# EAGLE design jnz-rev4 (EAGLE 7.6.0)
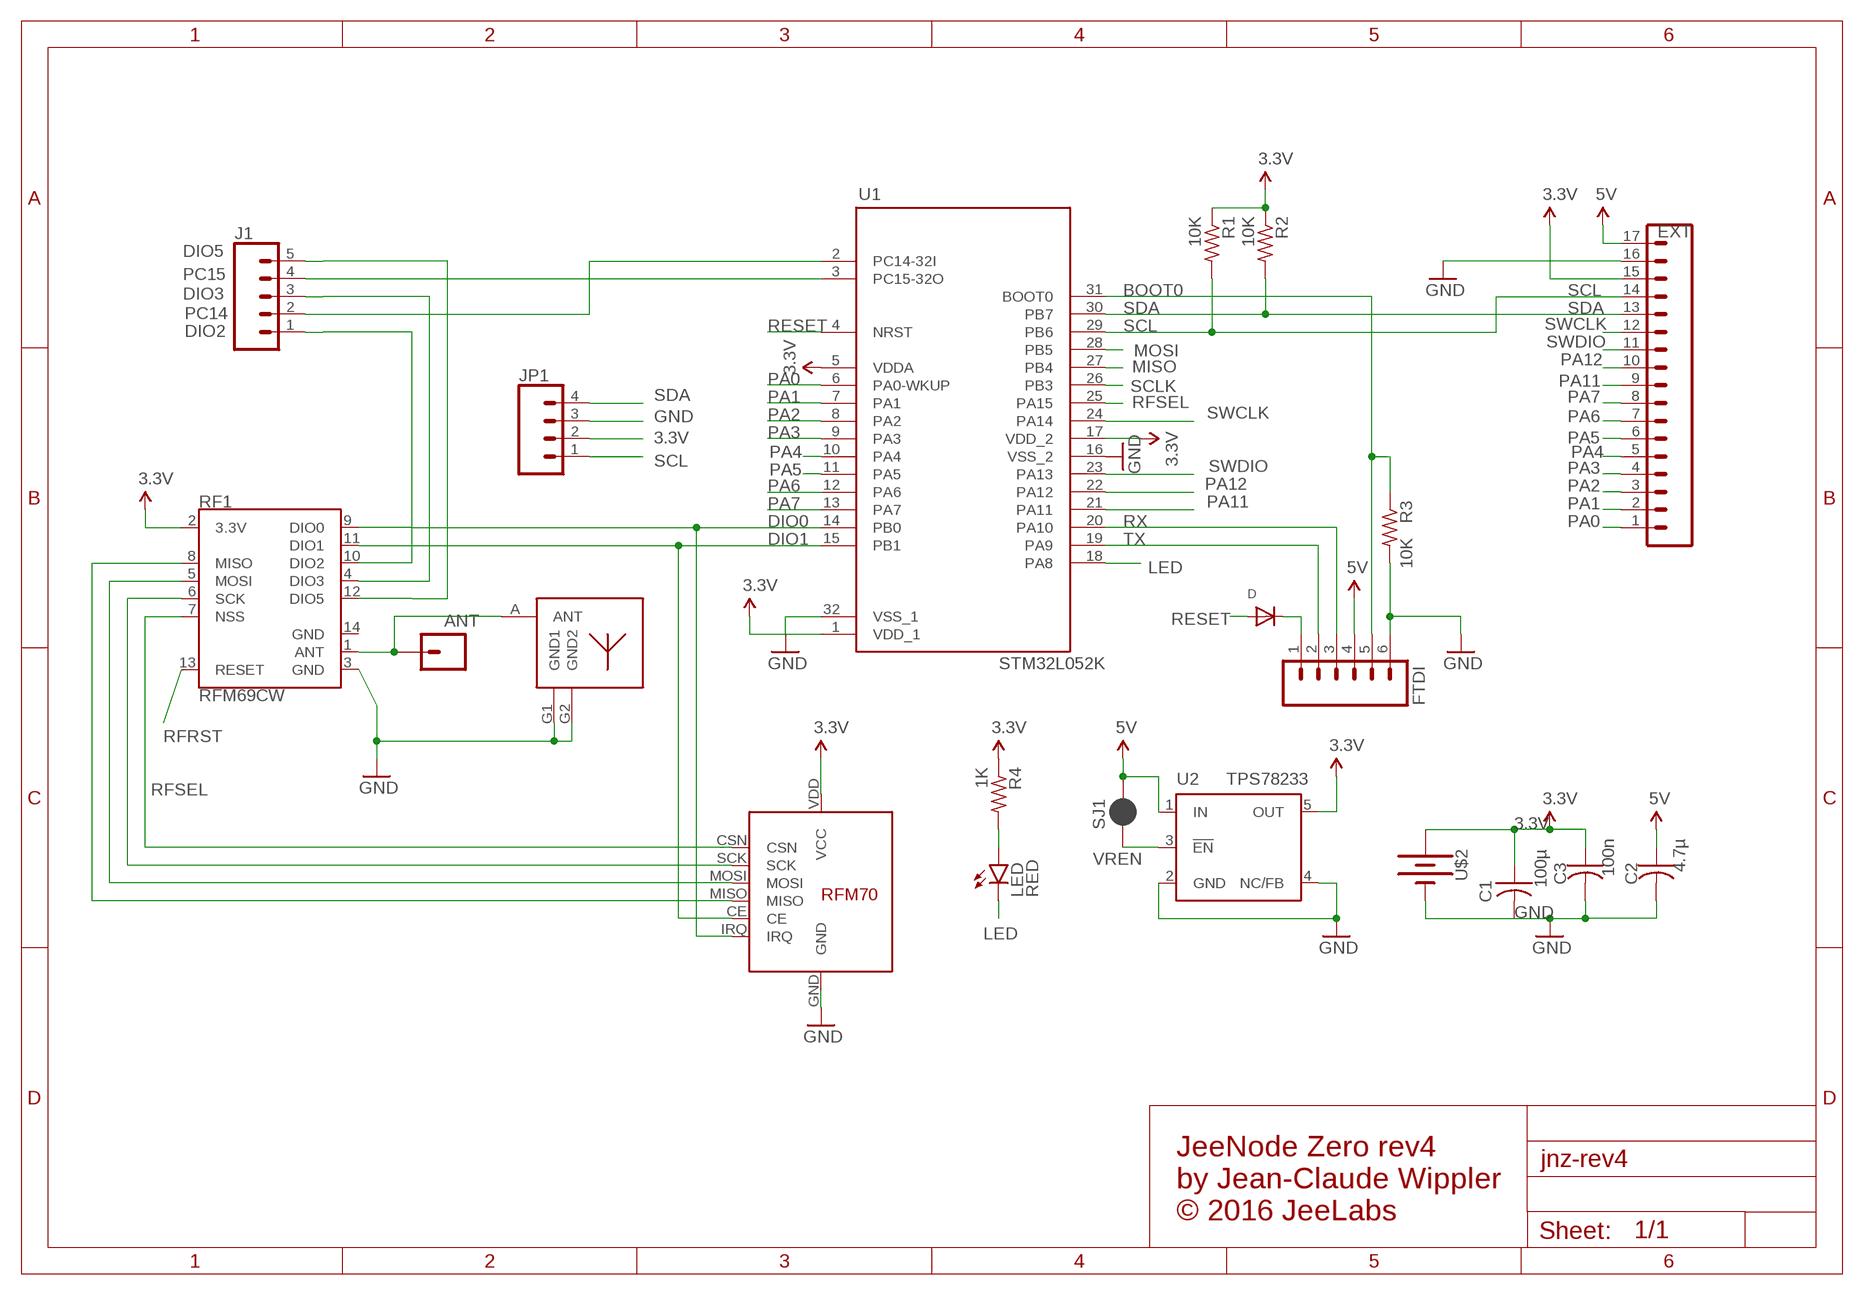
[diagram p0: schematic, sheet 1]

## Parts
ANT  CONN_01PTH_NO_SILK_KIT  [1X01NS_KIT]
C1  100µ  C-USC1206  [C1206]
C2  4.7µ  C-USC0805  [C0805]
C3  100n  C-USC0603  [C0603]
D  DIODESOD-323F  [SOD-323F]
EXT  CONN_17NOSILK  [1X17_NO_SILK]
FTDI  CONN_06NO_SILK_FEMALE_PTH  [1X06_NO_SILK]
J1  CONN_05NO_SILK  [1X05_NO_SILK]
JP1  CONN_04SMD_RA_FEMALE  [1X04_SMD_RA_FEMALE]
LED  RED  LED0603  [LED-0603]
R1  10K  R-US_R0603  [R0603]
R2  10K  R-US_R0603  [R0603]
R3  10K  R-US_R0603  [R0603]
R4  1K  R-US_R0603  [R0603]
RF1  RFM69CW  RFM69CW-915MHZ  [RFM69CW-XXXS2]
RF2  RFM75  RFM70  [RFM70]
SJ1  JUMPER-SMT_2_NC_PASTE_NO-SILK  [SMT-JUMPER_2_NC_PASTE_NO-SILK]
U1  STM32L052K  STM32L051KX  [TQFP32-08]
U2  TPS78233  TPS77001  [SOT23-DBV]
U$1  UFL  [UFL]
U$2  BATTERY-20MM_SMD_4LEGS  [BATTCON_20MM_4LEGS]

## Nets
3.3V [power]: C1.1 C3.1 EXT.15 JP1.2 R1.1 R2.1 R4.1 RF1.2(3.3V) RF2.VDD(VCC) U1.1(VDD_1) U1.5(VDDA) U1.17(VDD_2) U2.5(OUT) U$2.POSITIVE@1(+) U$2.POSITIVE@2(+) U$2.POSITIVE@3(+) U$2.POSITIVE@4(+)
5V [power]: C2.1 EXT.17 FTDI.4 SJ1.2 U2.1(IN)
BOOT0: FTDI.5 R3.1 U1.31(BOOT0)
DIO0: RF1.9(DIO0) RF2.IRQ U1.14(PB0)
DIO1: RF1.11(DIO1) RF2.CE U1.15(PB1)
DIO2: J1.1 RF1.10(DIO2)
DIO3: J1.3 RF1.4(DIO3)
DIO5: J1.5 RF1.12(DIO5)
GND: C1.2 C2.2 C3.2 EXT.16 FTDI.6 JP1.3 R3.2 RF1.3(GND) RF2.GND U1.16(VSS_2) U1.32(VSS_1) U2.2(GND) U2.4(NC/FB) U$1.G1(GND1) U$1.G2(GND2) U$2.NEGATIVE(-)
LED: LED.C U1.18(PA8)
MISO: RF1.8(MISO) RF2.MISO U1.27(PB4)
MOSI: RF1.5(MOSI) RF2.MOSI U1.28(PB5)
N$1: D.C FTDI.1
N$2: LED.A R4.2
N$13 [antenna]: ANT.1 RF1.1(ANT) U$1.A(ANT)
PA0: EXT.1 U1.6(PA0-WKUP)
PA1: EXT.2 U1.7(PA1)
PA2: EXT.3 U1.8(PA2)
PA3: EXT.4 U1.9(PA3)
PA4: EXT.5 U1.10(PA4)
PA5: EXT.6 U1.11(PA5)
PA6: EXT.7 U1.12(PA6)
PA7: EXT.8 U1.13(PA7)
PA11: EXT.9 U1.21(PA11)
PA12: EXT.10 U1.22(PA12)
PC14: J1.2 U1.2(PC14-32I)
PC15: J1.4 U1.3(PC15-32O)
RESET: D.A U1.4(NRST)
RFRST: RF1.13(RESET)
RFSEL: RF1.7(NSS) RF2.CSN U1.25(PA15)
RX: FTDI.3 U1.20(PA10)
SCL: EXT.14 JP1.1 R1.2 U1.29(PB6)
SCLK: RF1.6(SCK) RF2.SCK U1.26(PB3)
SDA: EXT.13 JP1.4 R2.2 U1.30(PB7)
SWCLK: EXT.12 U1.24(PA14)
SWDIO: EXT.11 U1.23(PA13)
TX: FTDI.2 U1.19(PA9)
VREN: SJ1.1 U2.3(!EN)

## Notes on the sheet
- JeeNode Zero rev4
  by Jean-Claude Wippler
  © 2016 JeeLabs

## Power pins joined to a net without a drawn wire
GND: RF1.14(GND)

## Library data of the parts
ANT = JeeLabs:CONN_01: Single connection point. Often used as Generic Header-pin footprint for 0.1 inch spaced/style header connections On any of the 0.1 inch spaced packages, you can populate with these: Break Away Headers - Straight <https://www.sparkfun.com/products/116> (PRT-00116) Break Away Male Headers - Right Angle <https://www.sparkfun.com/products/553> (PRT-00553) Female Headers <https://www.sparkfun.com/products/115> (PRT-00115) Break Away Headers - Machine Pin <https://www.sparkfun.com/products/117> (PRT-00117) Break Away Female Headers - Swiss Machine Pin <https://www.sparkfun.com/products/743> (PRT-00743) This device is also useful as a general connection point to wire up your design to another part of your project. Our various solder wires solder well into these plated through hole pads. Hook-Up Wire - Assortment (Stranded, 22 AWG) <https://www.sparkfun.com/products/11375> (PRT-11375) Hook-Up Wire - Assortment (Solid Core, 22 AWG) <https://www.sparkfun.com/products/11367> (PRT-11367) View the entire wire category on our website here <https://www.sparkfun.com/categories/141> Special notes: SMTSO-256-ET is a "flush mount" nut for a 4-40 screw. We mostly use this on specialty testbeds; it is a nice way to connect hardware to your PCB at an adjustable hieght. Also note, the SNAP packages are for using a snappable style connector. We sell a baggie of snaps and they are also used on two LilyPad designs: Snap Assortment - 30 pack (male and female) <https://www.sparkfun.com/products/11347> (DEV-11347) LilyPad Arduino SimpleSnap <https://www.sparkfun.com/products/10941> (DEV-10941) LilyPad SimpleSnap Protoboard <https://www.sparkfun.com/products/10940> (DEV-10940)
C1-C3 = adafruit:C-US: CAPACITOR, American symbol
D = adafruit:DIODE: Diode SMADIODE - SMA Surface Mount Package 20V 1A Schottky Diode Digikey: 641-1014-6-ND DO-1N4148 - Through Hole Small Current Diode SOD-123 20V 1 A (.5mV Vf) Schottky Diode - Digikey: MBRX120TPMSCT-ND SOD-323 10V 570mA (.38mV Vf, 3ns) Schottky Diode - Digikey: ZLLS410CT-ND SOD-523 30V 30mA Schottky Diode (RB751S-40TE61) - Digikey: RB751S-40TE61CT-ND SOT23-R/W - SOT23 Package (R = Solder Paste/Reflow Ovens, W = Hand-Soldering) BAT54Film 40V 300mA - Digikey: 497-7162-1-ND
EXT = JeeLabs:CONN_17: Multi connection point. Often used as Generic Header-pin footprint for 0.1 inch spaced/style header connections On any of the 0.1 inch spaced packages, you can populate with these: Break Away Headers - Straight <https://www.sparkfun.com/products/116> (PRT-00116) Break Away Male Headers - Right Angle <https://www.sparkfun.com/products/553> (PRT-00553) Female Headers <https://www.sparkfun.com/products/115> (PRT-00115) Break Away Headers - Machine Pin <https://www.sparkfun.com/products/117> (PRT-00117) Break Away Female Headers - Swiss Machine Pin <https://www.sparkfun.com/products/743> (PRT-00743) For SCREWTERMINALS and SPRING TERMINALS visit here: Screw Terimnals on SparkFun.com <https://www.sparkfun.com/search/results?term=Screw+Terminals> (5mm/3.5mm/2.54mm spacing) This device is also useful as a general connection point to wire up your design to another part of your project. Our various solder wires solder well into these plated through hole pads. Hook-Up Wire - Assortment (Stranded, 22 AWG) <https://www.sparkfun.com/products/11375> (PRT-11375) Hook-Up Wire - Assortment (Solid Core, 22 AWG) <https://www.sparkfun.com/products/11367> (PRT-11367) View the entire wire category on our website here <https://www.sparkfun.com/categories/141> Special notes: Molex polarized connector foot print use with SKU : PRT-08231 with associated crimp pins and housings. 1MM SMD Version SKU: PRT-10208 NOTES ON THE VARIANTS LOCK and LOCK_LONGPADS... This footprint was designed to help hold the alignment of a through-hole component (i.e. 6-pin header) while soldering it into place. You may notice that each hole has been shifted either up or down by 0.005 of an inch from it's more standard position (which is a perfectly straight line). This slight alteration caused the pins (the squares in the middle) to touch the edges of the holes. Because they are alternating, it causes a "brace" to hold the component in place. 0.005 has proven to be the perfect amount of "off-center" position when using our standard breakaway headers. Although looks a little odd when you look at the bare footprint, once you have a header in there, the alteration is very hard to notice. Also,if you push a header all the way into place, it is covered up entirely on the bottom side.
FTDI = JeeLabs:CONN_06: Multi connection point. Often used as Generic Header-pin footprint for 0.1 inch spaced/style header connections On any of the 0.1 inch spaced packages, you can populate with these: Break Away Headers - Straight <https://www.sparkfun.com/products/116> (PRT-00116) Break Away Male Headers - Right Angle <https://www.sparkfun.com/products/553> (PRT-00553) Female Headers <https://www.sparkfun.com/products/115> (PRT-00115) Break Away Headers - Machine Pin <https://www.sparkfun.com/products/117> (PRT-00117) Break Away Female Headers - Swiss Machine Pin <https://www.sparkfun.com/products/743> (PRT-00743) Arduino Stackable Header - 6 Pin <https://www.sparkfun.com/products/9280> (PRT-09280) For SCREWTERMINALS and SPRING TERMINALS visit here: Screw Terimnals on SparkFun.com <https://www.sparkfun.com/search/results?term=Screw+Terminals> (5mm/3.5mm/2.54mm spacing) This device is also useful as a general connection point to wire up your design to another part of your project. Our various solder wires solder well into these plated through hole pads. Hook-Up Wire - Assortment (Stranded, 22 AWG) <https://www.sparkfun.com/products/11375> (PRT-11375) Hook-Up Wire - Assortment (Solid Core, 22 AWG) <https://www.sparkfun.com/products/11367> (PRT-11367) View the entire wire category on our website here <https://www.sparkfun.com/categories/141>; PROD_ID: CONN-08437
J1 = JeeLabs:CONN_05: Multi connection point. Often used as Generic Header-pin footprint for 0.1 inch spaced/style header connections On any of the 0.1 inch spaced packages, you can populate with these: Break Away Headers - Straight <https://www.sparkfun.com/products/116> (PRT-00116) Break Away Male Headers - Right Angle <https://www.sparkfun.com/products/553> (PRT-00553) Female Headers <https://www.sparkfun.com/products/115> (PRT-00115) Break Away Headers - Machine Pin <https://www.sparkfun.com/products/117> (PRT-00117) Break Away Female Headers - Swiss Machine Pin <https://www.sparkfun.com/products/743> (PRT-00743) For SCREWTERMINALS and SPRING TERMINALS visit here: Screw Terimnals on SparkFun.com <https://www.sparkfun.com/search/results?term=Screw+Terminals> (5mm/3.5mm/2.54mm spacing) This device is also useful as a general connection point to wire up your design to another part of your project. Our various solder wires solder well into these plated through hole pads. Hook-Up Wire - Assortment (Stranded, 22 AWG) <https://www.sparkfun.com/products/11375> (PRT-11375) Hook-Up Wire - Assortment (Solid Core, 22 AWG) <https://www.sparkfun.com/products/11367> (PRT-11367) View the entire wire category on our website here <https://www.sparkfun.com/categories/141> Special notes: Molex polarized connector foot print use with SKU : PRT-08231 with associated crimp pins and housings. 1MM SMD Version SKU: PRT-10208
JP1 = JeeLabs:CONN_04: Multi connection point. Often used as Generic Header-pin footprint for 0.1 inch spaced/style header connections On any of the 0.1 inch spaced packages, you can populate with these: Break Away Headers - Straight <https://www.sparkfun.com/products/116> (PRT-00116) Break Away Male Headers - Right Angle <https://www.sparkfun.com/products/553> (PRT-00553) Female Headers <https://www.sparkfun.com/products/115> (PRT-00115) Break Away Headers - Machine Pin <https://www.sparkfun.com/products/117> (PRT-00117) Break Away Female Headers - Swiss Machine Pin <https://www.sparkfun.com/products/743> (PRT-00743) For SCREWTERMINALS and SPRING TERMINALS visit here: Screw Terimnals on SparkFun.com <https://www.sparkfun.com/search/results?term=Screw+Terminals> (5mm/3.5mm/2.54mm spacing) This device is also useful as a general connection point to wire up your design to another part of your project. Our various solder wires solder well into these plated through hole pads. Hook-Up Wire - Assortment (Stranded, 22 AWG) <https://www.sparkfun.com/products/11375> (PRT-11375) Hook-Up Wire - Assortment (Solid Core, 22 AWG) <https://www.sparkfun.com/products/11367> (PRT-11367) View the entire wire category on our website here <https://www.sparkfun.com/categories/141> Special notes: Molex polarized connector foot print use with SKU : PRT-08231 with associated crimp pins and housings. 1MM SMD Version SKU: PRT-10208
LED = SparkFun-LED:LED: LEDs Standard schematic elements and footprints for 5mm, 3mm, 1206, and 0603 sized LEDs. 5mm - Spark Fun Electronics SKU : COM-00529 (and others)
R1-R4 = adafruit:R-US_: RESISTOR, American symbol
RF1 = JeeLabs:RFM69: Hope RF RFM69CW ISM Transceiver Module The RFM69CW radio module by HopeRF is a compact, powerful radio transceiver module for swapping data packets in the 868 MHz ISM band, using standard and enhanced FSK modulation. The radio is great for sub-compact designs; just 4mm of mounted height from using an SMD precision crystal. Datasheet <http://www.hoperf.com/upload/rf/RFM69CW-V1.1.pdf>; PROD_ID: IC-11996; VALUE: 915MHz
RF2 = JeeLabs:RFM70
SJ1 = SparkFun-Jumpers:JUMPER-SMT_2_NC_PASTE: Normally closed solder jumper This jumper has an aperture in the stencil to allow solder paste to bridge the split in the wire so it's normally closed (NC). Wick off the solder to open the connection. Reapply solder to reclose the connection.
U1 = JeeLabs:STM32L051KX
U2 = texas:TPS770*: ULTRALOW-POWER 50-mA LOW-DROPOUT LINEAR REGULATORS 50-mA Low-Dropout Regulator Source: http://focus.ti.com/lit/ds/symlink/tps77001.pdf; MF: TEXAS INSTRUMENTS; MPN: TPS77001DBVT; OC_FARNELL: 8461554; OC_NEWARK: 77C1171
U$1 = JeeLabs:UFL
U$2 = JeeLabs:BATTERY: Battery - Single Cell A variety of battery chemistries, sizes, and footprints. Device List: 20MM_PTH - Coin Cell Battery Holder - 20mm (PTH) <https://www.sparkfun.com/products/783> 12MM_SMD - Coin Cell Battery Holder - 12mm (SMD) <https://www.sparkfun.com/products/10592> 12MM_PTH - Coin Cell Battery Holder - 12mm (PTH) <https://www.sparkfun.com/products/7948> 20MM_SMD - 20mm Coin Cell Battery Holder (SMD) (2 legs) Used on the Big Time Watch Kit <https://www.sparkfun.com/products/11734> 20MM_SMD_4LEGS - Coin Cell Battery Holder - 20mm (SMD) <https://www.sparkfun.com/products/11892> 20MM_SMD_4LEGS_OVERPASTE - Coin Cell Battery Holder - 20mm (SMD) <https://www.sparkfun.com/products/11892> (Over-paste on the legs) 24.5MM_PTH - Coin Cell Battery Holder - 24.5mm (PTH) <https://www.sparkfun.com/products/8863> 9V - 9V Battery Holder - PC Mount Used on the SparkFun SparkPunk Sound Kit <https://www.sparkfun.com/products/11177> and SparkFun SparkPunk Sequencer Kit <https://www.sparkfun.com/products/12707> 18650 - Battery Holder - 18650 (PTH) <https://www.sparkfun.com/products/13113> AA - Battery Holder - 1xAA (PTH) <https://www.sparkfun.com/products/7949> AAA - Battery Holder - 1xAAA (PTH) <https://www.sparkfun.com/products/12718> AA_KIT - Battery Holder - 1xAA (PTH) <https://www.sparkfun.com/products/7949> Special kit package - pads only have exposed copper on one side of the board. AAA_KIT - Battery Holder - 1xAAA (PTH) <https://www.sparkfun.com/products/12718> Special kit package - pads only have exposed copper on one side of the board.; PROD_ID: BATT-10373; SF_SKU: PRT-11892

## Net classes
1 power: width 0.203 mm
2 antenna: width 0.508 mm, clearance 0.254 mm

## Board
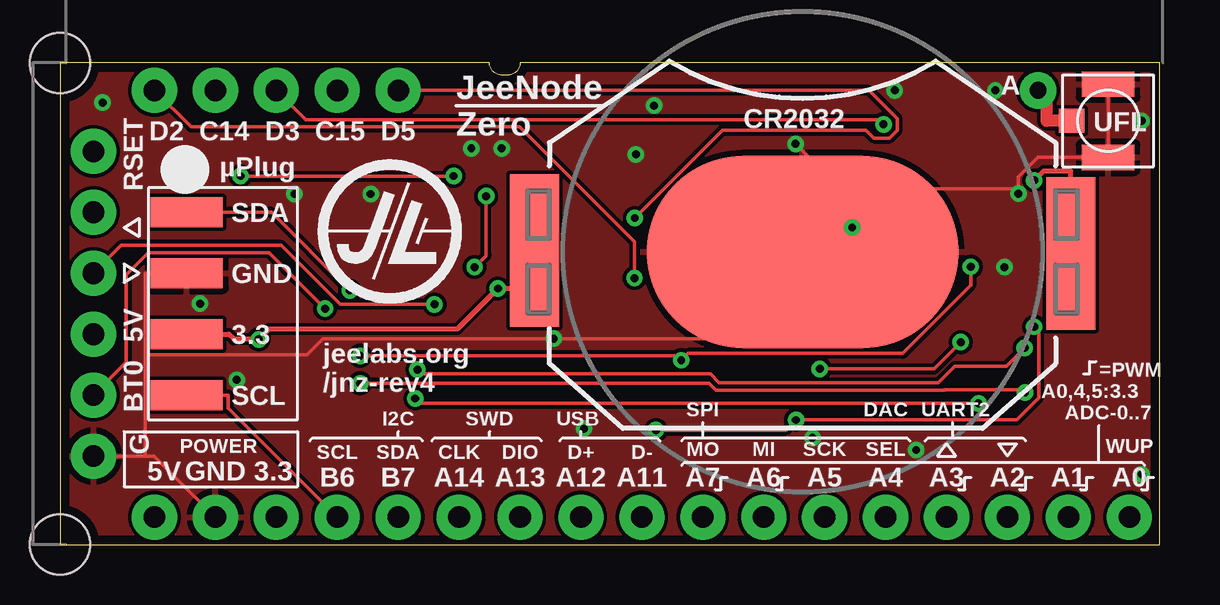
[diagram p1: board, top side]
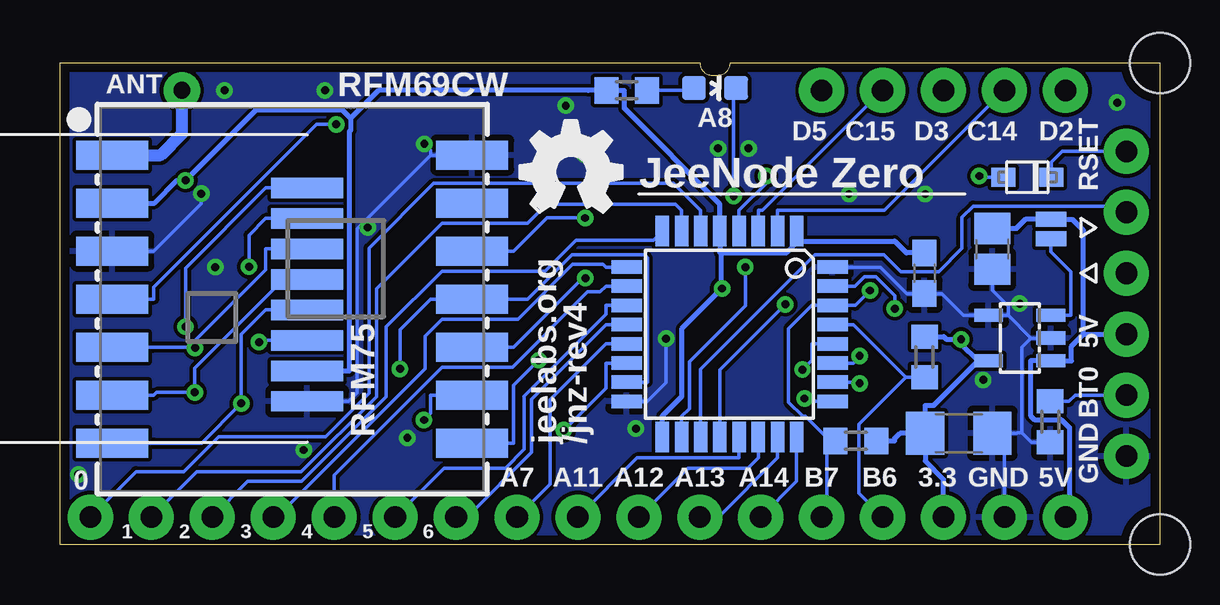
[diagram p2: board, bottom side, seen from below]

Size 45.85 x 20.07 mm. Coordinates in mm from the lower left corner, seen from the top.
Outline: 0,0 45.85,0 45.85,20.07 19.18,20.07 arc-90 18.67,19.56 18.42,19.56 arc-90 17.91,20.07 17.91,20.06 arc90 17.9,20.07 0,20.07 0,0
Copper layers (1*16): Top 0.0356mm / dielectric 1.5011mm / Bottom 0.0356mm
Design rules "ComboDRU *": minimum track width 6mil, minimum drill 13mil, track to track 6mil, track to pad 6mil, pad to pad 6mil, via to via 6mil, smd to smd 6mil, copper to edge 15mil, drill to drill 10mil, minimum pad ring 10mil, minimum via ring 7mil, stop-mask expansion 3mil, vias tented up to drill 20mil, thermal gap 10mil
Holes 2.5 mm at 0,20.07 0,0

### Footprints (pad centres in the part's own frame; a part is rotated, then mirrored left to right if it is on the bottom)
1X01NS_KIT = drill 0.7 pad 1.524: 1 0,0
C1206 = smd 1.6 x 1.8: 1 -1.4,0; 2 1.4,0
C0805 = smd 1.3 x 1.5: 1 -0.85,0; 2 0.85,0
C0603 = smd 1.1 x 1: 1 -0.85,0; 2 0.85,0
SOD-323F = smd 1 x 0.8: A -1,0; C 1,0
1X17_NO_SILK = drill 0.9 pad 1.88: 1 0,0; 2 2.54,0; 3 5.08,0; 4 7.62,0; 5 10.16,0; 6 12.7,0; 7 15.24,0; 8 17.78,0; 9 20.32,0; 10 22.86,0; 11 25.4,0; 12 27.94,0; 13 30.48,0; 14 33.02,0; 15 35.56,0; 16 38.1,0; 17 40.64,0
1X06_NO_SILK = drill 0.9 pad 1.88: 1 0,0; 2 2.54,0; 3 5.08,0; 4 7.62,0; 5 10.16,0; 6 12.7,0
1X05_NO_SILK = drill 0.9 pad 1.88: 1 0,0; 2 2.54,0; 3 5.08,0; 4 7.62,0; 5 10.16,0
1X04_SMD_RA_FEMALE = smd 1.25 x 3: 1 -3.81,2.145; 2 -1.27,2.145; 3 1.27,2.145; 4 3.81,2.145
LED-0603 = smd 1 x 1: A 0,-0.877; C 0,0.877
R0603 = smd 1 x 1.1: 1 -0.85,0; 2 0.85,0
RFM69CW-XXXS2 = smd 3 x 1.2: 1 -7.5,6; 2 -7.5,4; 3 -7.5,2; 4 -7.5,0; 5 -7.5,-2; 6 -7.5,-4; 7 -7.5,-6; 8 7.5,-6; 9 7.5,-4; 10 7.5,-2; 11 7.5,0; 12 7.5,2; 13 7.5,4; 14 7.5,6
RFM70 = smd 3 x 0.85: CE -8.4,2.16; CSN -8.4,0.89; GND -8.4,4.7; IRQ -8.4,-4.19; MISO -8.4,-2.92; MOSI -8.4,-1.65; SCK -8.4,-0.38; VDD -8.4,3.43
SMT-JUMPER_2_NC_PASTE_NO-SILK = smd 0.635 x 1.27: 1 -0.406,0; 2 0.406,0
TQFP32-08 = smd 1.27 x 0.559: 1 -4.293,2.8; 2 -4.293,2; 3 -4.293,1.2; 4 -4.293,0.4; 5 -4.293,-0.4; 6 -4.293,-1.2; 7 -4.293,-2; 8 -4.293,-2.8; 17 4.293,-2.8; 18 4.293,-2; 19 4.293,-1.2; 20 4.293,-0.4; 21 4.293,0.4; 22 4.293,1.2; 23 4.293,2; 24 4.293,2.8 | smd 0.559 x 1.27: 9 -2.8,-4.293; 10 -2,-4.293; 11 -1.2,-4.293; 12 -0.4,-4.293; 13 0.4,-4.293; 14 1.2,-4.293; 15 2,-4.293; 16 2.8,-4.293; 25 2.8,4.293; 26 2,4.293; 27 1.2,4.293; 28 0.4,4.293; 29 -0.4,4.293; 30 -1.2,4.293; 31 -2,4.293; 32 -2.8,4.293
SOT23-DBV = smd 0.55 x 1.2: 1 -0.95,-1.3; 2 0,-1.3; 3 0.95,-1.3; 4 0.95,1.3; 5 -0.95,1.3
UFL = smd 1 x 1.05: A 0,-1.525 | smd 1.05 x 2.2: G1 -1.525,0; G2 1.525,0
BATTCON_20MM_4LEGS = smd 13 x 8: NEGATIVE 0,0 | smd 2.032 x 3.175: POSITIVE@1 -11.176,1.651; POSITIVE@2 -11.176,-1.524; POSITIVE@3 11.176,1.524; POSITIVE@4 11.176,-1.651

### Placement (x,y rotation side)
ANT  40.77,18.92 0 top
C1  8.38,4.64 0 bottom
C2  6.99,12.32 270 bottom
C3  9.81,11.3 270 bottom
D  5.52,15.3 0 bottom
EXT  44.58,1.14 180 top
FTDI  1.4,16.38 270 top
J1  3.94,18.92 0 top
JP1  7.43,10.03 90 top
LED  18.54,19.02 270 bottom
LOGO1  OSHW_LOGO_FILLX0150-NT  [OSHW_FILLX150_NOTEXT]  26.67,13.84 0 bottom
R1  9.81,7.81 270 bottom
R2  12.67,4.32 180 bottom
R3  4.57,5.11 270 bottom
R4  22.22,18.92 0 bottom
RF1  36.16,10.22 0 bottom
RF2  43.94,10.67 180 bottom
SJ1  4.54,13.14 90 bottom
U1  17.94,8.76 270 bottom
U2  5.84,8.6 90 bottom
U$1  43.69,17.65 270 top
U$2  30.96,12.19 180 top

### Tracks (layer width: path | path; a pad name or v marks a point on that pad's centre or on a via)
3.3V  (via drill 0.33 pad 0.69)
  Top 0.203: v40.61,15.17 41,15.56 42.13,15.56 U$2.POSITIVE@2 U$2.POSITIVE@1 | U$2.POSITIVE@4 U$2.POSITIVE@3 v18.25,10.67 16.56,8.98 8.71,8.98 v8.29,8.55 7.25,8.55 7.04,8.76 JP1.2
  Bottom 0.203: 18.27,12.14 18.25,12.17 15.55,12.17 15.14,12.58 15.14,12.64 | 18.27,12.14 18.27,10.69 v18.25,10.67 19.94,8.98 19.94,6.16 20.74,5.36 U1.17 | 18.27,12.14 18.3,12.17 18.34,12.17 U1.5 18.34,14.19 22.32,18.17 22.32,18.92 R4.1 23.83,18.92 32.56,18.92 33.73,17.76 | 33.73,17.76 33.73,17.26 33.79,17.21 33.79,7.24 RF2.VDD | 33.73,17.76 34.08,18.11 37.68,18.11 v40.61,15.17 40.96,15.17 41.91,14.22 RF1.2 | C3.1 10.56,12.15 11.05,12.64 15.14,12.64 | U1.1 15.14,12.64 | 7.57,7.65 8.29,8.37 v8.29,8.55 8.89,8.55 9.01,8.66 R1.1 | 7.57,7.65 9.43,5.79 9.78,5.79 C1.1 | C1.1 9.78,3.48 9.02,2.72 EXT.15 | U2.5 7.57,7.65 | R2.1 11.06,4.32 11.06,4.41 10.84,4.63 C1.1
5V
  Bottom 0.203: EXT.17 3.77,1.31 3.77,4.87 4.11,5.21 5.23,5.21 5.4,5.37 5.4,7.65 U2.1 4.33,7.65 3.69,7.65 3.69,8.26 3.19,8.76 | 3.19,8.76 3.19,13.08 3.65,13.55 SJ1.2 5.6,13.55 5.98,13.17 C2.1 | 3.19,8.76 FTDI.4
BOOT0  (via drill 0.33 pad 0.69)
  Top 0.152: v11.05,9.83 8.72,12.16 3.69,12.16 2.77,11.24 2.77,7.6 FTDI.5
  Bottom 0.152: U1.31 12.71,10.76 12.32,11.15 11.84,11.15 11.05,10.36 v11.05,9.83 | R3.1 3.79,5.96 3.53,6.22 FTDI.5
DIO0  (via drill 0.33 pad 0.69)
  Top 0.152: v24.84,4.76 30.25,4.76 v30.68,5.19 39.88,5.19 40.8,6.11 40.8,8.88 v40.61,9.07
  Bottom 0.152: v40.61,9.07 40.61,11.52 37.27,14.86 RF2.IRQ | U1.14 23.09,7.56 23.09,6.51 v24.84,4.76 | v30.68,5.19 30.39,5.48 30.39,6.22 RF1.9
DIO1  (via drill 0.33 pad 0.69)
  Top 0.152: v31.67,7.32 36.44,7.32 v37.55,8.43
  Bottom 0.152: U1.15 21.37,6.76 21.37,11.94 21.5,12.07 24.51,12.07 26.36,10.22 RF1.11 30.39,10.22 31.67,8.94 v31.67,7.32 | RF2.CE 37.27,8.51 37.35,8.43 v37.55,8.43
DIO2  (via drill 0.33 pad 0.69)
  Top 0.152: J1.1 5.46,17.4 19.15,17.4 23.95,12.61 v23.95,11.1
  Bottom 0.152: v23.95,11.1 24.06,11.1 26.93,8.22 RF1.10
DIO3  (via drill 0.33 pad 0.69)
  Top 0.152: v34.33,17.51 34.13,17.71 10.23,17.71 J1.3
  Bottom 0.152: v34.33,17.51 35.14,17.51 41.94,10.71 41.94,10.22 RF1.4
DIO5  (via drill 0.33 pad 0.69)
  Top 0.152: v23.96,13.61 27.62,17.27 33.59,17.27 33.93,16.93 34.57,16.93 34.9,17.27 34.9,17.75 33.73,18.92 J1.5
  Bottom 0.152: v23.96,13.61 25.55,13.61 26.93,12.22 RF1.12
GND  (via drill 0.33 pad 0.69)
  Top 0.152: 39.95,14.82 v39.95,14.62 | 39.95,14.82 39.95,15.32 40.76,16.13 U$1.G2 43.69,18.42 U$1.G1 | 39.95,14.82 32.53,14.82 | 3.56,7.91 10.3,7.91 10.96,8.58 v20.58,8.58 27.34,8.58 U$2.NEGATIVE 32.47,13.71 32.47,14.76 32.53,14.82 | 3.56,7.91 3.56,11.3 JP1.3 | 3.56,3.68 3.56,7.91 | 3.56,3.68 FTDI.6 | EXT.16 3.94,3.68 3.56,3.68 | v30.66,16.7 32.53,14.82
  Bottom 0.152: v39.95,14.62 39.95,14.21 41.94,12.22 RF1.3 | U1.16 21.37,5.96 20.58,6.75 v20.58,8.58 | 5.37,8.6 6.31,9.55 | 5.75,4.66 5.75,8.22 5.37,8.6 | C2.2 6.99,10.59 6.97,10.59 6.31,9.93 6.31,9.55 | 6.31,9.55 U2.4 8.18,9.55 9.08,10.45 C3.2 10.54,10.45 11.65,11.56 U1.32 | 30.39,16.22 33.46,13.16 33.46,6.32 33.81,5.97 RF2.GND | 5.75,4.66 5.35,4.26 R3.2 | 5.75,4.66 5.92,4.66 5.95,4.63 6.48,4.63 | U2.2 5.37,8.6 | RF1.14 30.39,16.22 | 30.39,16.22 30.39,16.43 v30.66,16.7 | C1.2 6.48,4.63 | EXT.16 6.48,4.63
  other vias: 9.78,14.6 12.95,14.6 24,16.26 24.77,18.29 45.09,17.65 35.69,3.94 31.37,4.44 17.14,16.51 39.37,11.56 18.41,16.51 45.09,2.92 38.99,18.92 33.02,13.21 21.84,4.83 1.78,18.42 34.8,18.92 5.84,10.03 7.37,6.86
  pour Top: -1.14,-1.4 -1.14,22.73 47.12,22.73 47.12,-1.4
  pour Bottom: -1.14,-2.67 -1.14,21.46 47.12,21.46 47.12,-2.67
LED  (via drill 0.33 pad 0.69)
  Top 0.152: v17.28,11.56 17.77,12.04 v17.77,14.52
  Bottom 0.152: U1.18 19.94,5.33 19.61,5.66 19.61,7.61 17.28,9.94 v17.28,11.56 | LED.C 17.77,18.92 v17.77,14.52
MISO  (via drill 0.33 pad 0.69)
  Top 0.152: v12.51,7.86 25.71,7.86 v25.9,7.68 26.18,7.96 35.14,7.96 37.97,10.79 v37.97,11.57
  Bottom 0.152: v12.51,7.86 12.51,7.83 12.78,7.56 U1.27 | v37.97,11.57 37.97,12.89 37.27,13.59 RF2.MISO | v25.9,7.68 26.93,6.64 26.93,4.22 RF1.8
MOSI  (via drill 0.33 pad 0.69)
  Top 0.152: v14.9,7.29 15.08,7.11 27.11,7.11 27.47,6.74 36.62,6.74 37.3,7.42 39.44,7.42 v40.21,8.2
  Bottom 0.152: U1.28 14.51,8.36 14.51,7.68 v14.9,7.29 | 40.37,8.35 v40.21,8.2 | 40.37,8.35 40.49,8.22 41.94,8.22 RF1.5 | 40.37,8.35 37.27,11.45 37.27,12.32 RF2.MOSI
N$1
  Bottom 0.152: D.C 4.53,15.93 4.07,16.38 FTDI.1
N$2
  Bottom 0.152: R4.2 19.51,18.92 LED.A
N$13
  Top 0.508: U$1.A 41.13,17.65 41.13,18.56 ANT.1
  Bottom 0.508: RF1.1 41.66,16.22 40.77,17.11 ANT.1
PA0
  Bottom 0.152: U1.6 19.14,13.92 20.27,15.05 30.26,15.05 32.96,12.35 32.96,6.3 34.77,4.49 39.24,4.49 40.7,3.04 42.68,3.04 EXT.1
PA1
  Bottom 0.152: U1.7 19.94,13.92 20.2,14.18 25.57,14.18 26.35,13.39 29.92,13.39 32.66,10.65 32.66,6.17 35.79,3.03 40.15,3.03 EXT.2
PA2
  Bottom 0.152: EXT.3 38.01,2.63 35.77,2.63 32.24,6.15 32.24,9.07 29.92,11.39 25.62,11.39 24.34,12.68 21.11,12.68 U1.8
PA3
  Bottom 0.152: EXT.4 36.82,1.14 30.63,7.33 30.63,8.68 29.92,9.39 26.75,9.39 24.48,11.67 23.2,11.67 23.09,11.56 U1.9
PA4
  Bottom 0.152: EXT.5 34.42,2.89 29.91,7.39 26.99,7.39 23.85,10.53 23.33,10.53 23.09,10.76 U1.10
PA5
  Bottom 0.152: U1.11 23.09,9.96 23.09,9.59 26.5,6.19 26.5,3.96 27.28,3.19 29.83,3.19 EXT.6
PA6
  Bottom 0.152: EXT.7 28.89,1.14 26.2,3.83 26.2,6.06 23.09,9.16 U1.12
PA7
  Bottom 0.152: U1.13 23.09,8.36 25.43,6.03 25.43,2.51 EXT.8
PA11
  Bottom 0.152: U1.21 17.54,3.61 21.79,3.61 EXT.9
PA12
  Bottom 0.152: U1.22 16.74,3.61 17.16,3.18 19.68,3.18 EXT.10
PC14
  Bottom 0.152: U1.2 15.94,13.92 11.48,13.92 J1.2
PC15
  Bottom 0.152: U1.3 16.74,13.92 16.56,13.92 J1.4
RESET  (via drill 0.33 pad 0.69)
  Top 0.152: v7.52,15.35 v16.41,15.35
  Bottom 0.152: U1.4 17.54,13.92 16.41,15.05 v16.41,15.35 | D.A 7.25,15.3 7.3,15.35 v7.52,15.35
RFSEL  (via drill 0.33 pad 0.69)
  Top 0.152: v14.81,6.08 15.02,5.88 v38.29,5.88
  Bottom 0.152: U1.25 14.69,5.96 v14.81,6.08 | RF1.7 41.94,4.22 39.94,4.22 v38.29,5.88 38.29,8.76 37.27,9.78 RF2.CSN
RX  (via drill 0.33 pad 0.69)
  Top 0.152: v15.61,10 11.69,10 9.23,12.46 2.56,12.46 FTDI.3
  Bottom 0.152: U1.20 18.34,7.27 v15.61,10
SCL
  Top 0.152: JP1.1 7.01,6.22 7.01,5.69 EXT.14
  Bottom 0.152: 10.59,6.96 12.55,5 12.55,2.13 EXT.14 | 10.59,6.96 10.59,6.97 12.78,9.16 U1.29 | 10.59,6.96 10.2,6.96 R1.2
SCLK  (via drill 0.33 pad 0.69)
  Top 0.152: v40.23,6.34 40.12,6.45 36.87,6.45 36.86,6.44 27.34,6.44 27.06,6.71 v12.51,6.71
  Bottom 0.152: U1.26 12.56,6.76 v12.51,6.71 | RF2.SCK 36.52,11.05 40.23,7.34 v40.23,6.34 41.81,6.34 41.94,6.22 RF1.6
SDA  (via drill 0.33 pad 0.69)
  Top 0.152: v12.08,10.58 8.82,13.84 7.01,13.84 JP1.4
  Bottom 0.152: 13.87,4.32 13.87,4.44 14.76,5.33 14.87,5.33 15.47,5.94 15.47,9 14.51,9.96 U1.30 12.7,9.96 v12.08,10.58 | 13.87,4.32 13.87,1.37 EXT.13 | R2.2 13.87,4.32
SWCLK
  Bottom 0.152: U1.24 15.14,2.64 EXT.12
SWDIO
  Bottom 0.152: EXT.11 18.4,1.14 15.94,3.61 U1.23
TX
  Bottom 0.152: U1.19 19.14,7.31 14.38,12.07 11.49,12.07 10.79,11.37 9.21,11.37 8.25,12.34 8.25,13.63 7.78,14.1 1.66,14.1 FTDI.2
VREN
  Bottom 0.152: SJ1.1 4.54,12.19 3.71,11.37 3.71,9.55 U2.3

### Text on the board
bPlace: RFM69CW | ANT | JeeNode Zero
tNames: A | CR2032 | D2 | C14 | D3 | C15 | D5 | UFL | RSET | JeeNode / Zero | µPlug | SDA | GND | 5V | 3.3 | jeelabs.org / /jnz-rev4 | BT0 | SCL | =PWM | SPI | DAC | UART2 | A0,4,5:3.3 | ADC-0..7 | G | I2C | SWD | USB | POWER | SCL | SDA | CLK | DIO | D+ | D- | MO | MI | SCK | SEL | WUP | 5V | GND | 3.3 | B6 | B7 | A14 | A13 | A12 | A11 | A7 | A6 | A5 | A4 | A3 | A2 | A1 | A0
bNames: D2 | C14 | D3 | C15 | D5 | A8 | RSET | 5V | BT0 | jeelabs.org / /jnz-rev4 | GND | 5V | GND | 3.3 | B6 | B7 | A14 | A13 | A12 | A11 | A7 | 0 | 6 | 5 | 4 | 3 | 2 | 1